# Altium schematic sheet Su_BAITAP1.schdoc
size A3
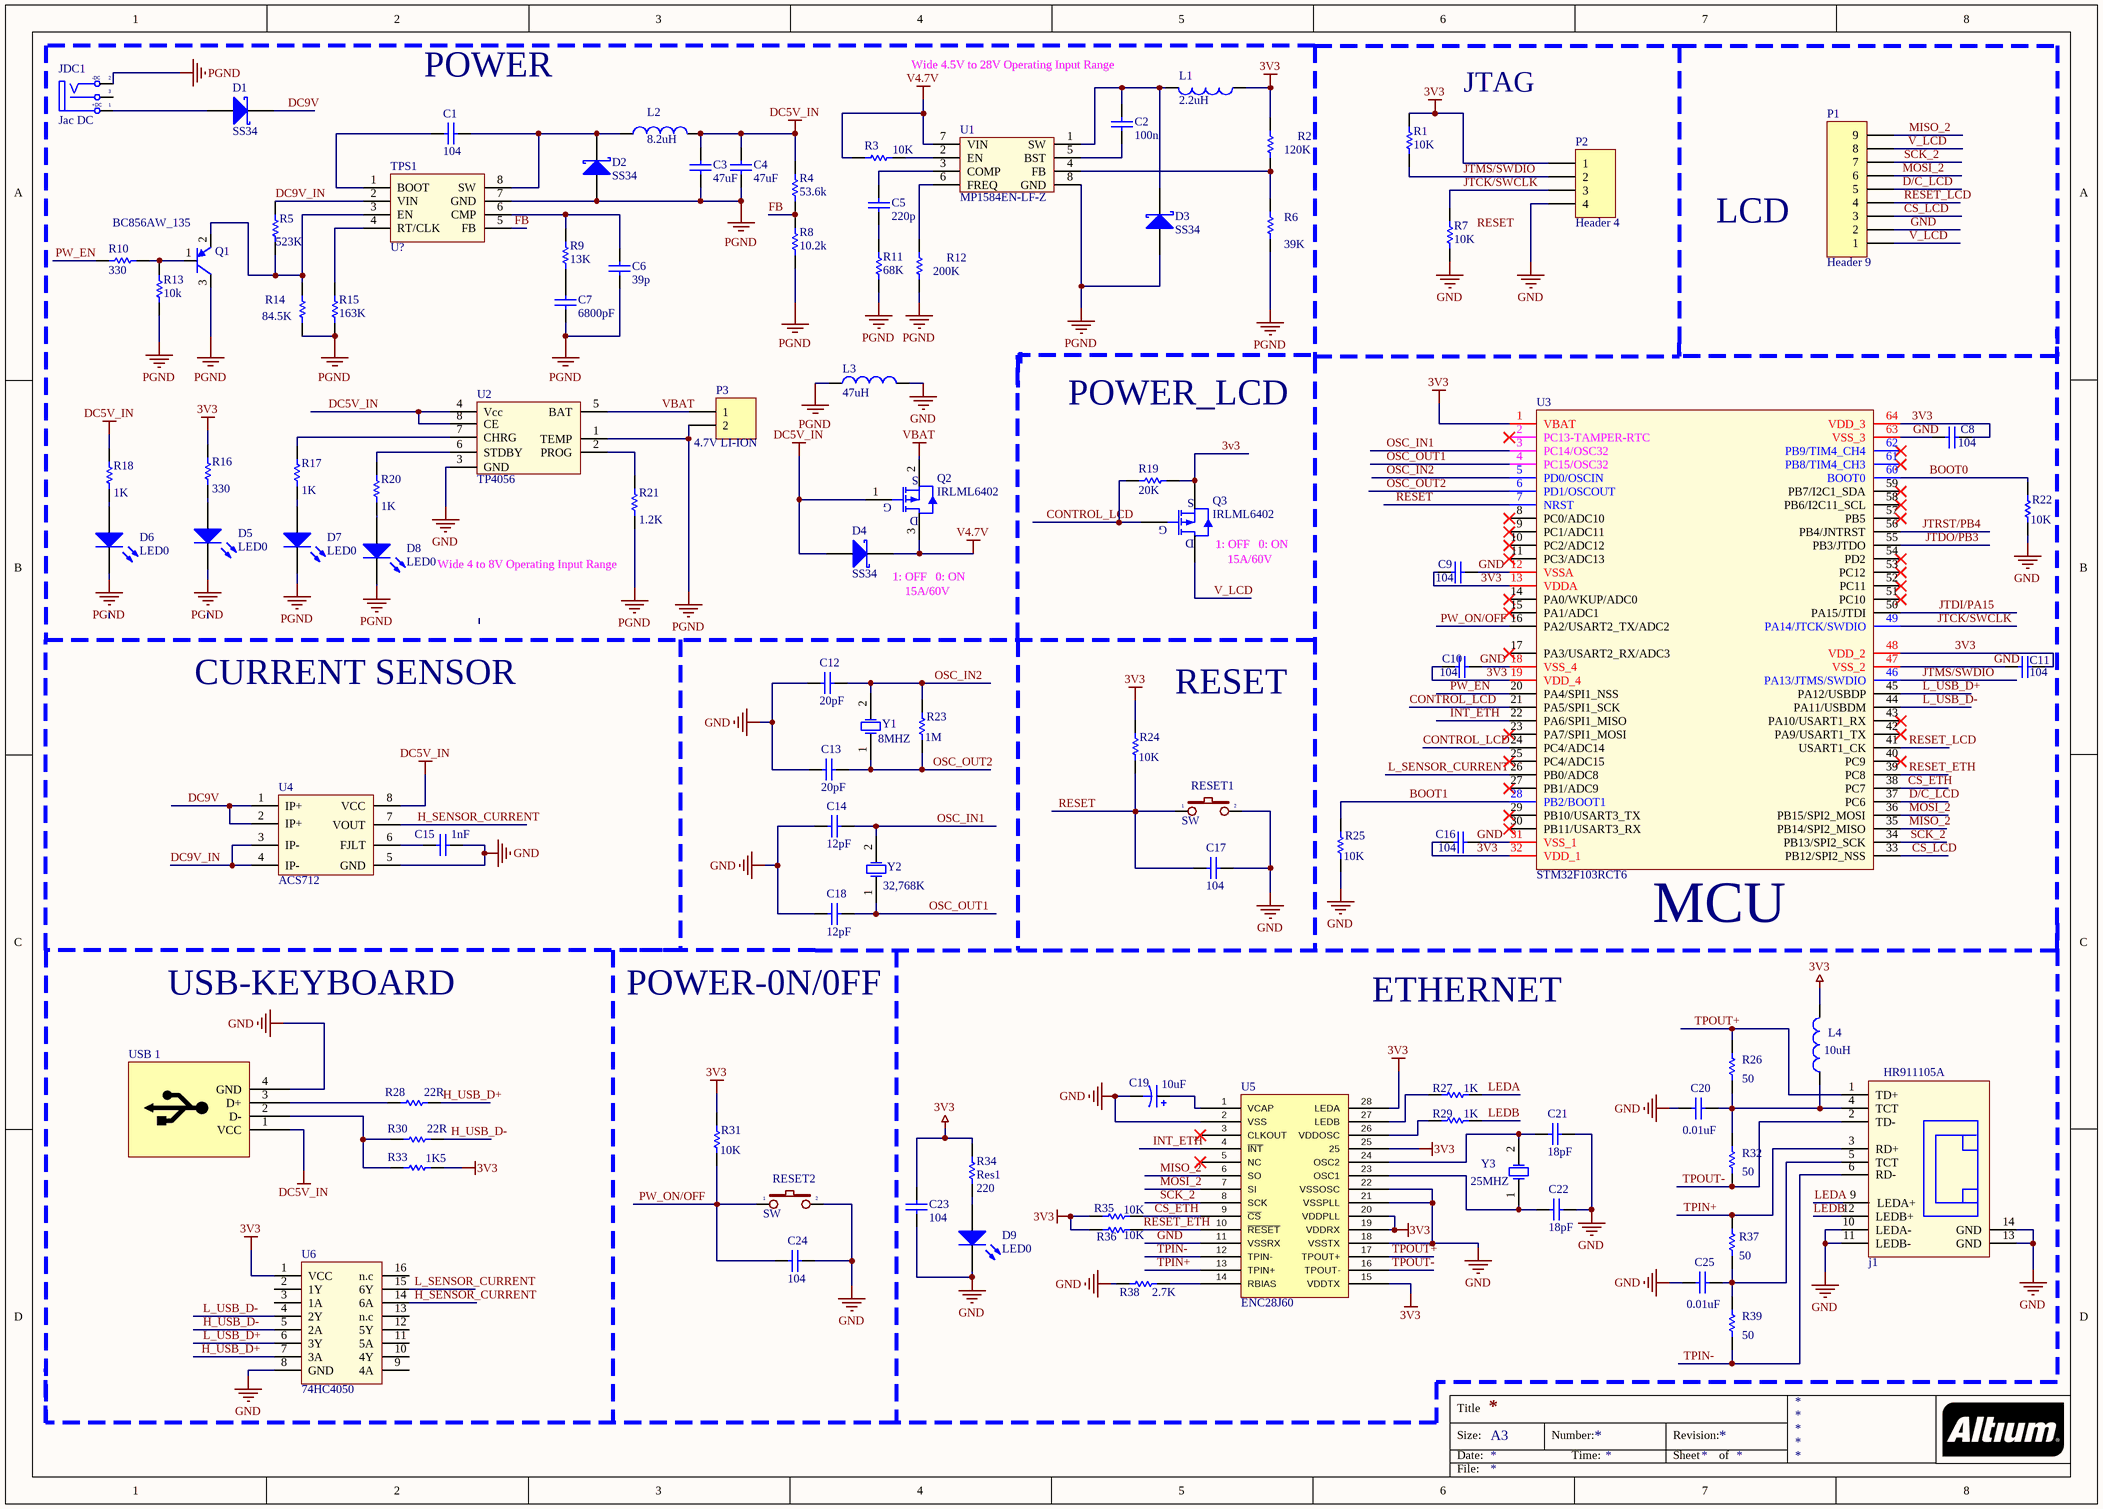
[diagram p0: Su_BAITAP1.schdoc]

## Parts
C1  value 104  [Cap Ceramic 0805 SMD]  (hidden comment: Cap)
C2  value 100n  [Cap Ceramic 0805 SMD]  (hidden comment: Cap)
C3  value 47uF  [Cap-SMD]  (hidden comment: Cap)
C4  value 47uF  [Cap-SMD]  (hidden comment: Cap)
C5  value 220p  [Cap Ceramic 0805 SMD]  (hidden comment: Cap)
C6  value 39p  [Cap Ceramic 0805 SMD]  (hidden comment: Cap)
C7  value 6800pF  [Cap Ceramic 0805 SMD]  (hidden comment: Cap)
C8  value 104  [Cap Ceramic 0805 SMD]  (hidden comment: Cap)
C9  value 104  [Cap Ceramic 0805 SMD]  (hidden comment: Cap)
C10  value 104  [Cap Ceramic 0805 SMD]  (hidden comment: Cap)
C11  value 104  [Cap Ceramic 0805 SMD]  (hidden comment: Cap)
C12  value 20pF  [Cap Ceramic 0805 SMD]  (hidden comment: Cap)
C13  value 20pF  [Cap Ceramic 0805 SMD]  (hidden comment: Cap)
C14  value 12pF  [Cap Ceramic 0805 SMD]  (hidden comment: Cap)
C15  value 1nF  [Cap Ceramic 0805 SMD]  (hidden comment: Cap)
C16  value 104  [Cap Ceramic 0805 SMD]  (hidden comment: Cap)
C17  value 104  [Cap Ceramic 0805 SMD]  (hidden comment: Cap)
C18  value 12pF  [Cap Ceramic 0805 SMD]  (hidden comment: Cap)
C19  value 10uF  [C_FC_10UF_16V]  (hidden comment: Cap Pol1)
C20  value 0.01uF  [Cap Ceramic 0805 SMD]  (hidden comment: Cap)
C21  value 18pF  [Cap Ceramic 0805 SMD]  (hidden comment: Cap)
C22  value 18pF  [Cap Ceramic 0805 SMD]  (hidden comment: Cap)
C23  value 104  [Cap Ceramic 0805 SMD]  (hidden comment: Cap)
C24  value 104  [Cap Ceramic 0805 SMD]  (hidden comment: Cap)
C25  value 0.01uF  [Cap Ceramic 0805 SMD]  (hidden comment: Cap)
D1  SS34  [SS34]
D2  SS34  [SS34]
D3  SS34  [SS34]
D4  SS34  [SS34]
D5  LED0  [SM-LED-0805-Blue]
D6  LED0  [SM-LED-0805-Blue]
D7  LED0  [SM-LED-0805-Blue]
D8  LED0  [SM-LED-0805-Blue]
D9  LED0  [SM-LED-0805-Blue]
j1  HR911105A  [RJ45-J1B1211CCD]
JDC1  Jac DC  [DC-IN]
L1  value 2.2uH  [2.2uH]  (hidden comment: Inductor)
L2  value 8.2uH  [INDC1608L]  (hidden comment: Inductor)
L3  value 47uH  [Res 0805 SMD]  (hidden comment: Inductor)
L4  value 10uH  [10uH]  (hidden comment: Inductor)
P1  Header 9  [CON9]
P2  Header 4  [HDR1X4]
P3  4.7V LI-ION  [HDR1X2]
Q1  BC856AW_135  [BC856AW_135]
Q2  IRLML6402  [8# IRLML9301- TRPbF]
Q3  IRLML6402  [8# IRLML9301- TRPbF]
R1  value 10K  [Res 0805 SMD]  (hidden comment: Res1)
R2  value 120K  [Res 0805 SMD]  (hidden comment: Res1)
R3  value 10K  [Res 0805 SMD]  (hidden comment: Res1)
R4  value 53.6k  [Res 0805 SMD]  (hidden comment: Res1)
R5  value 523K  [Res 0805 SMD]  (hidden comment: Res1)
R6  value 39K  [Res 0805 SMD]  (hidden comment: Res1)
R7  value 10K  [Res 0805 SMD]  (hidden comment: Res1)
R8  value 10.2k  [Res 0805 SMD]  (hidden comment: Res1)
R9  value 13K  [Res 0805 SMD]  (hidden comment: Res1)
R10  value 330  [Res 0805 SMD]  (hidden comment: Res1)
R11  value 68K  [Res 0805 SMD]  (hidden comment: Res1)
R12  value 200K  [Res 0805 SMD]  (hidden comment: Res1)
R13  value 10k  [Res 0805 SMD]  (hidden comment: Res1)
R14  value 84.5K  [Res 0805 SMD]  (hidden comment: Res1)
R15  value 163K  [Res 0805 SMD]  (hidden comment: Res1)
R16  value 330  [Res 0805 SMD]  (hidden comment: Res1)
R17  value 1K  [Res 0805 SMD]  (hidden comment: Res1)
R18  value 1K  [Res 0805 SMD]  (hidden comment: Res1)
R19  value 20K  [Res 0805 SMD]  (hidden comment: Res1)
R20  value 1K  [Res 0805 SMD]  (hidden comment: Res1)
R21  value 1.2K  [Res 0805 SMD]  (hidden comment: Res1)
R22  value 10K  [Res 0805 SMD]  (hidden comment: Res1)
R23  value 1M  [Res 0805 SMD]  (hidden comment: Res1)
R24  value 10K  [Res 0805 SMD]  (hidden comment: Res1)
R25  value 10K  [Res 0805 SMD]  (hidden comment: Res1)
R26  value 50  [Res 0805 SMD]  (hidden comment: Res1)
R27  value 1K  [RESC2012(0805)]  (hidden comment: Res1)
R28  value 22R  [Res 0805 SMD]  (hidden comment: Res1)
R29  value 1K  [RESC2012(0805)]  (hidden comment: Res1)
R30  value 22R  [Res 0805 SMD]  (hidden comment: Res1)
R31  value 10K  [Res 0805 SMD]  (hidden comment: Res1)
R32  value 50  [Res 0805 SMD]  (hidden comment: Res1)
R33  value 1K5  [Res 0805 SMD]  (hidden comment: Res1)
R34  Res1  value 220  [Res 0805 SMD]
R35  value 10K  [Res 0805 SMD]  (hidden comment: Res1)
R36  value 10K  [Res 0805 SMD]  (hidden comment: Res1)
R37  value 50  [Res 0805 SMD]  (hidden comment: Res1)
R38  value 2.7K  [Res 0805 SMD]  (hidden comment: Res1)
R39  value 50  [Res 0805 SMD]  (hidden comment: Res1)
RESET1  SW  [SW4]
RESET2  SW  [SW4]
TPS1  U?  [TPS54360]
U1  MP1584EN-LF-Z  [TPS54360]
U2  TP4056  [TPS54360]
U3  STM32F103RCT6  [STM32F103RCT6]
U4  ACS712  [ACS712]
U5  ENC28J60  [ENC28J60]
U6  74HC4050  [74hc4050]
USB_1  USB  [USB_B_TYPE]  (value not drawn)
Y1  8MHZ  [XT2]
Y2  32,768K  [R38]
Y3  25MHZ  [XT2]

## Nets
3V3: C8.2 C9.1 C10.1 C11.2 C16.1 C23.1 L1.1 L4.2 P2.1 Q3.2(S) R1.1 R2.1 R16.2 R19.2 R24.2 R31.2 R33.1 R34.2 R35.2 R36.2 U3.1(VBAT) U3.13(VDDA) U3.19(VDD_4) U3.32(VDD_1) U3.48(VDD_2) U3.64(VDD_3) U5.15(VDDTX) U5.19(VDDRX) U5.20(VDDPLL) U5.25 U5.28(LEDA) U6.1(VCC)
DC5V_IN: C3.1 C4.1 D4.1(A) L2.2 Q2.1(G) R4.2 R18.2 U2.4(Vcc) U2.8(CE) U4.8(VCC) USB_1.1(VCC)
GND: C8.1 C9.2 C11.1 C12.1 C13.1 C14.1 C15.2 C17.2 C18.1 C19.2 C20.1 C21.1 C22.1 C23.2 C24.2 C25.1 D9.2(K) j1.10(LEDA-) j1.11(LEDB-) j1.13(GND) j1.14(GND) L3.2 P1.2 P2.4 R7.2 R22.1 R25.1 R38.2 RESET1.2 RESET2.2 U2.3(GND) U3.12(VSSA) U3.47(VSS_2) U3.63(VSS_3) U4.5(GND) U5.2(VSS) U5.11(VSSRX) U5.18(VSSTX) U5.21(VSSPLL) U5.22(VSSOSC) U6.8(GND) USB_1.4(GND)
PGND: C3.2 C4.2 C6.2 C7.2 D2.1(A) D3.1(A) D5.2(K) D6.2(K) D7.2(K) D8.2(K) JDC1.2(TN) L3.1 P3.2 Q1.3(C) R6.2 R8.1 R11.2 R12.2 R13.1 R14.1 R15.1 R21.1 TPS1.7(GND) U1.8(GND) U2.1(TEMP)
V4.7V: D4.2(K) Q2.3(D) R3.2 U1.7(VIN)
VBAT: P3.1 Q2.2(S) U2.5(BAT)
BOOT0: R22.2 U3.60(BOOT0)
BOOT1: R25.2 U3.28(PB2/BOOT1)
CONTROL_LCD: Q3.1(G) R19.1 U3.21(PA5/SPI1_SCK) U3.24(PC4/ADC14)
CS_ETH: R35.1 U3.38(PC7) U5.9(~{CS})
CS_LCD: P1.3 U3.33(PB12/SPI2_NSS)
D/C_LCD: P1.5 U3.37(PC6)
DC9V: D1.2(K) U4.1(IP+) U4.2(IP+)
DC9V_IN: R5.2 TPS1.2(VIN) U4.3(IP-) U4.4(IP-)
FB: R4.1 R8.2 TPS1.5(FB)
H_SENSOR_CURRENT: U4.7(VOUT) U6.14(6A)
H_USB_D+: R28.1 U6.7(3A)
H_USB_D-: R30.1 U6.5(2A)
INT_ETH: U3.22(PA6/SPI1_MISO) U5.4(~{INT})
JTCK/SWCLK: P2.3 R7.1 U3.49(PA14/JTCK/SWDIO)
JTDI/PA15: U3.50(PA15/JTDI)
JTDO/PB3: U3.55(PB3/JTDO)
JTMS/SWDIO: P2.2 R1.2 U3.46(PA13/JTMS/SWDIO)
JTRST/PB4: U3.56(PB4/JNTRST)
L_SENSOR_CURRENT: U3.26(PB0/ADC8) U6.15(6Y)
L_USB_D+: U3.45(PA12/USBDP) U6.6(3Y)
L_USB_D-: U3.44(PA11/USBDM) U6.4(2Y)
LEDA: j1.9(LEDA+) R27.1
LEDB: j1.12(LEDB+) R29.1
MISO_2: P1.9 U3.35(PB14/SPI2_MISO) U5.6(SO)
MOSI_2: P1.6 U3.36(PB15/SPI2_MOSI) U5.7(SI)
OSC_IN1: C14.2 U3.3(PC14/OSC32) Y2.2(OSC2)
OSC_IN2: C12.2 R23.2 U3.5(PD0/OSCIN) Y1.2(OSC2)
OSC_OUT1: C18.2 U3.4(PC15/OSC32) Y2.1(OSC1)
OSC_OUT2: C13.2 R23.1 U3.6(PD1/OSCOUT) Y1.1(OSC1)
PW_EN: R10.2 U3.20(PA4/SPI1_NSS)
PW_ON/OFF: U3.16(PA2/USART2_TX/ADC2)
RESET: U3.7(NRST)
RESET_ETH: R36.1 U3.39(PC8) U5.10(~{RESET})
RESET_LCD: P1.4 U3.41(USART1_CK)
SCK_2: P1.7 U3.34(PB13/SPI2_SCK) U5.8(SCK)
TPIN+: j1.3(RD+) R37.2 U5.13(TPIN+)
TPIN-: j1.6(RD-) R39.1 U5.12(TPIN-)
TPOUT+: j1.1(TD+) R26.2 U5.17(TPOUT+)
TPOUT-: j1.2(TD-) R32.1 U5.16(TPOUT-)
V_LCD: P1.1 P1.8 Q3.3(D)
NetC1_1: C1.1 D2.2(K) L2.1 TPS1.8(SW)
NetC1_2: C1.2 TPS1.1(BOOT)
NetC2_1: C2.1 U1.5(BST)
NetC2_2: C2.2 D3.2(K) L1.2 U1.1(SW)
NetC5_1: C5.1 U1.3(COMP)
NetC5_2: C5.2 R11.1
NetC6_1: C6.1 R9.2 TPS1.6(CMP)
NetC7_1: C7.1 R9.1
NetC10_2: C10.2 U3.18(VSS_4)
NetC15_1: C15.1 U4.6(FJLT)
NetC16_2: C16.2 U3.31(VSS_1)
NetC17_1: C17.1 R24.1 RESET1.1
NetC19_1: C19.1 U5.1(VCAP)
NetC20_2: C20.2 j1.4(TCT) L4.1 R26.1 R32.2
NetC21_2: C21.2 U5.24(OSC2) Y3.2(OSC2)
NetC22_2: C22.2 U5.23(OSC1) Y3.1(OSC1)
NetC24_1: C24.1 R31.1 RESET2.1
NetC25_2: C25.2 j1.5(TCT) R37.1 R39.2
NetD1_1: D1.1(A) JDC1.1(T)
NetD5_1: D5.1(A) R16.1
NetD6_1: D6.1(A) R18.1
NetD7_1: D7.1(A) R17.1
NetD8_1: D8.1(A) R20.1
NetD9_1: D9.1(A) R34.1
NetQ1_1: Q1.1(B) R10.1 R13.2
NetQ1_2: Q1.2(E) R5.1 R14.2 TPS1.3(EN)
NetR2_2: R2.2 R6.1 U1.4(FB)
NetR3_1: R3.1 U1.2(EN)
NetR12_1: R12.1 U1.6(FREQ)
NetR15_2: R15.2 TPS1.4(RT/CLK)
NetR17_2: R17.2 U2.7(CHRG)
NetR20_2: R20.2 U2.6(STDBY)
NetR21_2: R21.2 U2.2(PROG)
NetR27_2: R27.2 U5.27(LEDB)
NetR28_2: R28.2 USB_1.3(D+)
NetR29_2: R29.2 U5.26(VDDOSC)
NetR30_2: R30.2 R33.2 USB_1.2(D-)
NetR38_1: R38.1 U5.14(RBIAS)

Not connected (* = marked no-connect by the designer): JDC1 3(S); U3 2(PC13-TAMPER-RTC)* 8(PC0/ADC10)* 9(PC1/ADC11)* 10(PC2/ADC12)* 11(PC3/ADC13)* 14(PA0/WKUP/ADC0)* 15(PA1/ADC1)* 17(PA3/USART2_RX/ADC3)* 23(PA7/SPI1_MOSI)* 25(PC4/ADC15)* 27(PB1/ADC9)* 29(PB10/USART3_TX)* 30(PB11/USART3_RX)* 40(PC9)* 42(PA9/USART1_TX)* 43(PA10/USART1_RX)* 51(PC10)* 52(PC11)* 53(PC12)* 54(PD2)* 57(PB5)* 58(PB6/I2C11_SCL)* 59(PB7/I2C1_SDA)* 61(PB8/TIM4_CH3)* 62(PB9/TIM4_CH4)*; U5 3(CLKOUT)* 5(NC)*; U6 2(1Y) 3(1A) 9(4A) 10(4Y) 11(5A) 12(5Y) 13(n.c) 16(n.c); USB_1 5 6

## Notes on the sheet
- (near C1) POWER
- Wide 4.5V to 28V Operating Input Range
- JTAG
- LCD
- POWER_LCD
- Wide 4 to 8V Operating Input Range
- (near D4) 1: OFF   0: ON
- (near Q3) 1: OFF   0: ON
- (near Q3) 15A/60V
- 15A/60V
- CURRENT SENSOR
- (near R24) RESET
- (near U3) MCU
- USB-KEYBOARD
- (near C18) POWER-0N/0FF
- ETHERNET
- Labels drawn without touching a wire or pin: GND, RESET
- Title
- Size:
- Date:
- A3
- Number:
- Time:
- Revision:
- Sheet
- of
- File:
- (in symbol DCIN) -DC; +DC

## Library data of the parts
C1-C18 C20-C25 = Cap: Capacitor; Published: 8-Jun-2000; LatestRevisionDate: 17-Jul-2002; LatestRevisionNote: Re-released for DXP Platform.; PackageReference: RAD-0.3; Publisher: Altium Limited
  C2 C5 C8-C18 C20-C25: PackageDescription: Radial Cap, Thru-Hole; 2 Leads; 0.3 in Pin Spacing
C19 = Cap Pol1: Polarized Capacitor (Radial); Published: 8-Jun-2000; LatestRevisionDate: 17-Jul-2002; LatestRevisionNote: Re-released for DXP Platform.; PackageReference: RB7.6-15; Publisher: Altium Limited; PackageDescription: Polarized Capacitor (Radial); 2 Leads
D1-D4 = D Schottky: Schottky Diode; Published: 8-Jun-2000; LatestRevisionDate: 17-Jul-2002; LatestRevisionNote: Re-released for DXP Platform.; PackageReference: SMB; Publisher: Altium Limited; PackageDescription: DO-214-AA/SMB; 2 C-Bend Leads; Body 5.3 x 3.6 mm, inc. leads (LxW); Code_JEDEC: DO-214-AA
D5-D9 = LED0: Typical INFRARED GaAs LED; Published: 8-Jun-2000; LatestRevisionDate: 08-Jul-2005; LatestRevisionNote: Mech Layer 1 removed.; PackageReference: LED-0; Publisher: Altium Limited; PackageDescription: LED; 2 Leads
j1 = HR911105A: Ethernet Connector
JDC1 = DCIN: Jac DC input; Value: Jac DC
L1-L4 = Inductor: Code_IEC: 1005; Published: 8-Jun-2000; LatestRevisionDate: 29-May-2009; LatestRevisionNote: IPC-7351 Footprint Added.; PackageReference: 0402-A; Publisher: Altium Limited; PackageDescription: Chip Inductor; Code_JEITA: 0402
P1 = Header 9: Header, 9-Pin; LatestRevisionDate: 17-Jul-2002; LatestRevisionNote: Re-released for DXP Platform.; Publisher: Altium Limited
P2 = Header 4: Header, 4-Pin; LatestRevisionDate: 17-Jul-2002; LatestRevisionNote: Re-released for DXP Platform.; Publisher: Altium Limited
P3 = Header 2: Header, 2-Pin; LatestRevisionDate: 17-Jul-2002; LatestRevisionNote: Re-released for DXP Platform.; Publisher: Altium Limited
Q1 = BC856AW_135: Trans PNP -80V -150mA SOT-323; ComponentLink1Description: Datasheet; ComponentLink1URL: D:\Dropbox\Datasheets\Transistors\N Channel Bipolar\2SA1015-BA.pdf; Unit Price: 0.0286
Q2 Q3 = 8#IRLML9301TRPBF: MOSFET MOSFT P-Ch -60V -15A; Manufacturer: International Rectifier; Rds On Max: 64mR; Input Capacitance: 388pF; Rise Time: 19ns; Recovery Time: 21ns; Nominal Vgs: -1.3V; Number of Elements: 1; Max Power Dissipation: 1.3W; Drain to Source Voltage (Vdss): 30V; Continuous Drain Current (ID): 3.6A; Gate to Source Voltage (Vgs): 20V; Drain to Source Resistance: 103mR; Turn-On Delay Time: 9.6ns; Turn-Off Delay Time: 16ns; Fall Time: 15ns; Element Configuration: Single; Drain to Source Breakdown Voltage: -30V; Manufacturer Part Number: IRLML9301TRPBF; Mount: Surface Mount; Case/Package: SOT-23; Number of Pins: 3; Min Operating Temperature: -55°C; Max Operating Temperature: 150°C; Packaging: Tape and Reel; Package Quantity: 1; Power Dissipation: 1.3W; Threshold Voltage: -1.3V; On-State Resistance: 64MR; Length: 3.04mm; Height: 1.02mm; Width: 1.4mm; Radiation Hardening: No; REACH SVHC: No SVHC; Lead Free: Lead Free; Supplier 1: Farnell; Supplier Part Number 1: 1829137
R1-R39 = Res1: Resistor; Published: 8-Jun-2000; LatestRevisionDate: 17-Jul-2002; LatestRevisionNote: Re-released for DXP Platform.; PackageReference: AXIAL-0.3; Publisher: Altium Limited
  R1-R3 R6 R7 R11 R12 R16-R39: PackageDescription: Axial Device, Thru-Hole; 2 Leads; 0.3 in Pin Spacing
RESET1 RESET2 = SW2: Switch button 2 pin; Value: SW chip 2 pin
TPS1 = TPS54360: 60 V Input, 3.5 A, Step Down Converter with Eco-mode™
U1 = MP1584EN-LF-Z: 3A, 1.5HZ, 28V Step-Down Converter
U4 = ACS712: Current Sensor
U5 = ENC28J60: Stand-Alone Ethernet Controller with SPI Interface
U6 = 74HC4050: 74HC4050 Non-Inv Hex Logic Down Coverter
USB_1 = USB_MH: USB conector
Y1-Y3 = XTAL: Crystal Oscillator; Published: 8-Jun-2000; LatestRevisionDate: 17-Jul-2002; LatestRevisionNote: Re-released for DXP Platform.; PackageReference: R38; Publisher: Altium Limited; PackageDescription: Crystal, Thru-Hole; 2 Leads; Body 3.1 x 8.2 mm (Dia.xH)